# Altium project Low_Level_ECU.PrjPcb (part 4 of 6)

## Sheet 10- RS485.SchDoc: RS485
size 420 x 297 mm; Revision: 1.0; SheetNumber: 10; SheetTotal: 13; Project: LOW LEVEL ECU
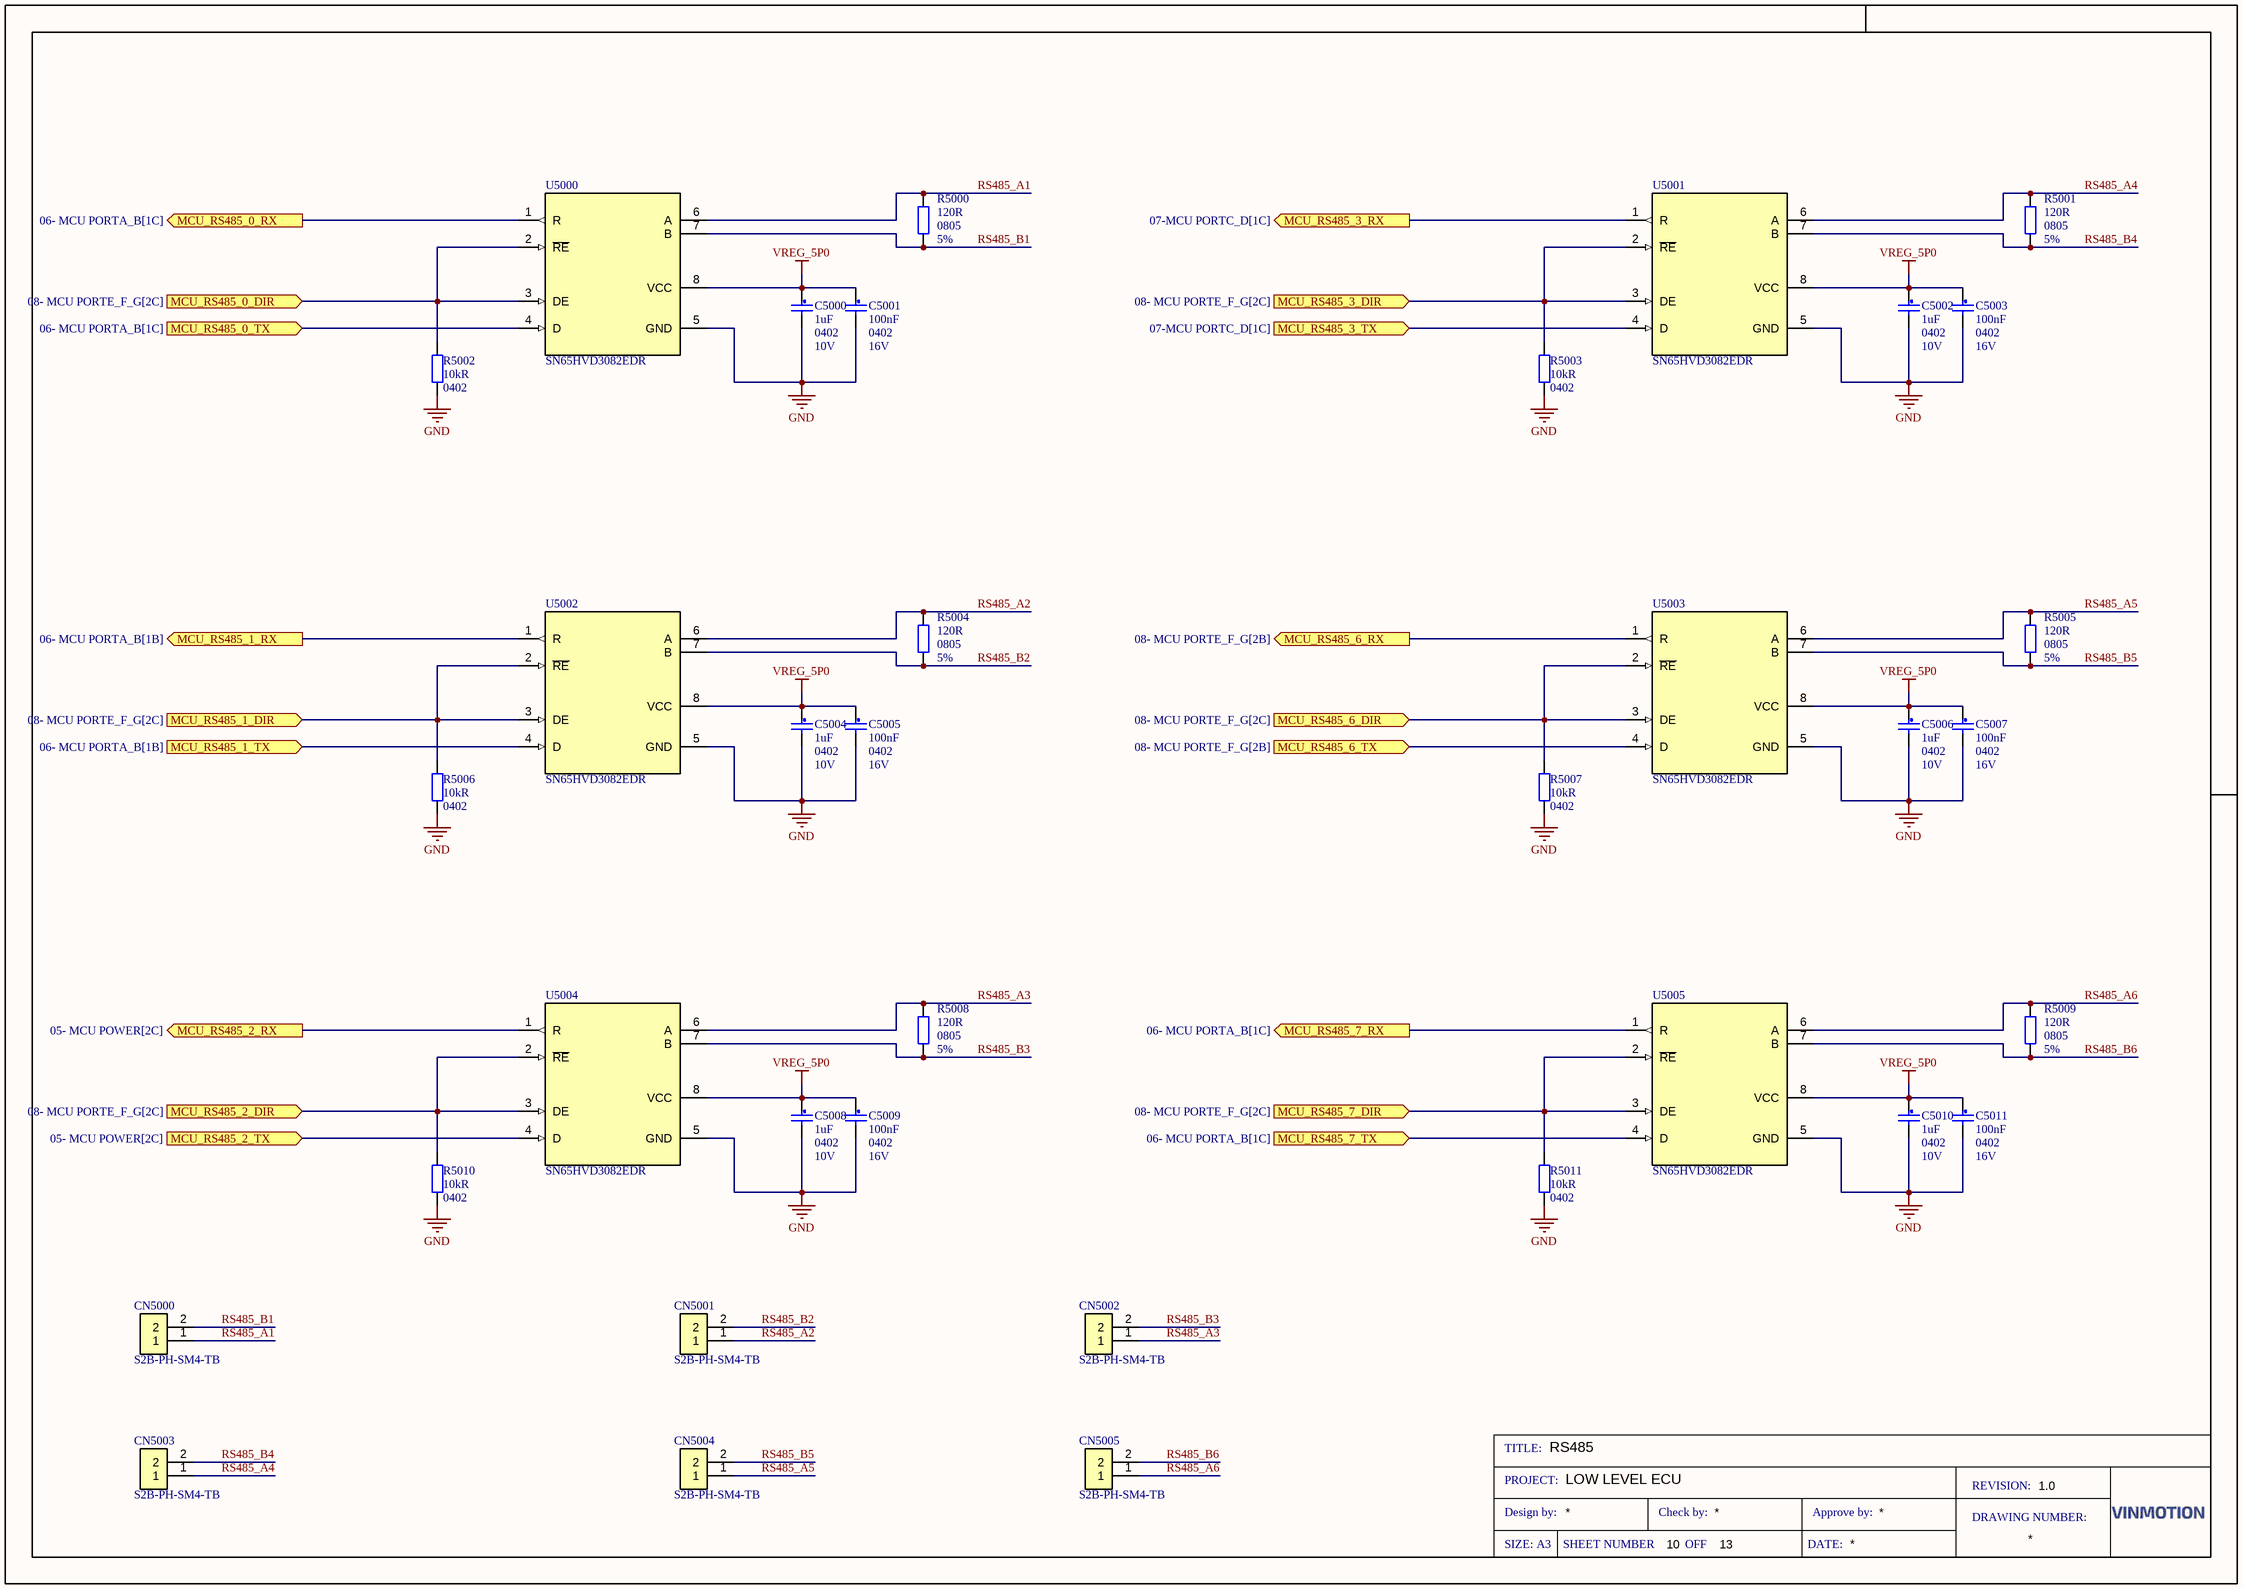
[diagram p8: 10- RS485.SchDoc]

### Parts
C5000  value 1uF  Case/Package: 0402  Rated DC Voltage (URdc): 10V  [CAP0402]  (hidden comment: CL05X105KP5NNNC)
C5001  Capacitance: 100nF  Case/Package: 0402  Voltage Rating (DC): 16V  [CAP0402]  (hidden comment: 0402YC104KAT2A)
C5002  value 1uF  Case/Package: 0402  Rated DC Voltage (URdc): 10V  [CAP0402]  (hidden comment: CL05X105KP5NNNC)
C5003  Capacitance: 100nF  Case/Package: 0402  Voltage Rating (DC): 16V  [CAP0402]  (hidden comment: 0402YC104KAT2A)
C5004  value 1uF  Case/Package: 0402  Rated DC Voltage (URdc): 10V  [CAP0402]  (hidden comment: CL05X105KP5NNNC)
C5005  Capacitance: 100nF  Case/Package: 0402  Voltage Rating (DC): 16V  [CAP0402]  (hidden comment: 0402YC104KAT2A)
C5006  value 1uF  Case/Package: 0402  Rated DC Voltage (URdc): 10V  [CAP0402]  (hidden comment: CL05X105KP5NNNC)
C5007  Capacitance: 100nF  Case/Package: 0402  Voltage Rating (DC): 16V  [CAP0402]  (hidden comment: 0402YC104KAT2A)
C5008  value 1uF  Case/Package: 0402  Rated DC Voltage (URdc): 10V  [CAP0402]  (hidden comment: CL05X105KP5NNNC)
C5009  Capacitance: 100nF  Case/Package: 0402  Voltage Rating (DC): 16V  [CAP0402]  (hidden comment: 0402YC104KAT2A)
C5010  value 1uF  Case/Package: 0402  Rated DC Voltage (URdc): 10V  [CAP0402]  (hidden comment: CL05X105KP5NNNC)
C5011  Capacitance: 100nF  Case/Package: 0402  Voltage Rating (DC): 16V  [CAP0402]  (hidden comment: 0402YC104KAT2A)
CN5000  S2B-PH-SM4-TB  [S2B-PH-SM4-TB]
CN5001  S2B-PH-SM4-TB  [S2B-PH-SM4-TB]
CN5002  S2B-PH-SM4-TB  [S2B-PH-SM4-TB]
CN5003  S2B-PH-SM4-TB  [S2B-PH-SM4-TB]
CN5004  S2B-PH-SM4-TB  [S2B-PH-SM4-TB]
CN5005  S2B-PH-SM4-TB  [S2B-PH-SM4-TB]
R5000  value 120R  Case/Package: 0805  Tolerance: 5%  [RES0805]  (hidden comment: ERJ-P06J121V)
R5001  value 120R  Case/Package: 0805  Tolerance: 5%  [RES0805]  (hidden comment: ERJ-P06J121V)
R5002  Resistance: 10kR  Case/Package: 0402  [RES0402]  (hidden comment: ERJ2GEJ103X)
R5003  Resistance: 10kR  Case/Package: 0402  [RES0402]  (hidden comment: ERJ2GEJ103X)
R5004  value 120R  Case/Package: 0805  Tolerance: 5%  [RES0805]  (hidden comment: ERJ-P06J121V)
R5005  value 120R  Case/Package: 0805  Tolerance: 5%  [RES0805]  (hidden comment: ERJ-P06J121V)
R5006  Resistance: 10kR  Case/Package: 0402  [RES0402]  (hidden comment: ERJ2GEJ103X)
R5007  Resistance: 10kR  Case/Package: 0402  [RES0402]  (hidden comment: ERJ2GEJ103X)
R5008  value 120R  Case/Package: 0805  Tolerance: 5%  [RES0805]  (hidden comment: ERJ-P06J121V)
R5009  value 120R  Case/Package: 0805  Tolerance: 5%  [RES0805]  (hidden comment: ERJ-P06J121V)
R5010  Resistance: 10kR  Case/Package: 0402  [RES0402]  (hidden comment: ERJ2GEJ103X)
R5011  Resistance: 10kR  Case/Package: 0402  [RES0402]  (hidden comment: ERJ2GEJ103X)
U5000  SN65HVD3082EDR  [SOIC127P590X175-8N]
U5001  SN65HVD3082EDR  [SOIC127P590X175-8N]
U5002  SN65HVD3082EDR  [SOIC127P590X175-8N]
U5003  SN65HVD3082EDR  [SOIC127P590X175-8N]
U5004  SN65HVD3082EDR  [SOIC127P590X175-8N]
U5005  SN65HVD3082EDR  [SOIC127P590X175-8N]

### Ports
MCU_RS485_0_DIR (in, see 08- MCU PORTE_F_G[2C]), MCU_RS485_0_RX (out, see 06- MCU PORTA_B[1C]), MCU_RS485_0_TX (in, see 06- MCU PORTA_B[1C]), MCU_RS485_1_DIR (in, see 08- MCU PORTE_F_G[2C]), MCU_RS485_1_RX (out, see 06- MCU PORTA_B[1B]), MCU_RS485_1_TX (in, see 06- MCU PORTA_B[1B]), MCU_RS485_2_DIR (in, see 08- MCU PORTE_F_G[2C]), MCU_RS485_2_RX (out, see 05- MCU POWER[2C]), MCU_RS485_2_TX (in, see 05- MCU POWER[2C]), MCU_RS485_3_DIR (in, see 08- MCU PORTE_F_G[2C]), MCU_RS485_3_RX (out, see 07-MCU PORTC_D[1C]), MCU_RS485_3_TX (in, see 07-MCU PORTC_D[1C]), MCU_RS485_6_DIR (in, see 08- MCU PORTE_F_G[2C]), MCU_RS485_6_RX (out, see 08- MCU PORTE_F_G[2B]), MCU_RS485_6_TX (in, see 08- MCU PORTE_F_G[2B]), MCU_RS485_7_DIR (in, see 08- MCU PORTE_F_G[2C]), MCU_RS485_7_RX (out, see 06- MCU PORTA_B[1C]), MCU_RS485_7_TX (in, see 06- MCU PORTA_B[1C])

### Nets
GND: C5000.2 C5001.2 C5002.2 C5003.2 C5004.2 C5005.2 C5006.2 C5007.2 C5008.2 C5009.2 C5010.2 C5011.2 R5002.1 R5003.1 R5006.1 R5007.1 R5010.1 R5011.1 U5000.5(GND) U5001.5(GND) U5002.5(GND) U5003.5(GND) U5004.5(GND) U5005.5(GND)
VREG_5P0: C5000.1 C5001.1 C5002.1 C5003.1 C5004.1 C5005.1 C5006.1 C5007.1 C5008.1 C5009.1 C5010.1 C5011.1 U5000.8(VCC) U5001.8(VCC) U5002.8(VCC) U5003.8(VCC) U5004.8(VCC) U5005.8(VCC)
RS485_A1: CN5000.1 R5000.1 U5000.6(A)
RS485_A2: CN5001.1 R5004.1 U5002.6(A)
RS485_A3: CN5002.1 R5008.1 U5004.6(A)
RS485_A4: CN5003.1 R5001.1 U5001.6(A)
RS485_A5: CN5004.1 R5005.1 U5003.6(A)
RS485_A6: CN5005.1 R5009.1 U5005.6(A)
RS485_B1: CN5000.2 R5000.2 U5000.7(B)
RS485_B2: CN5001.2 R5004.2 U5002.7(B)
RS485_B3: CN5002.2 R5008.2 U5004.7(B)
RS485_B4: CN5003.2 R5001.2 U5001.7(B)
RS485_B5: CN5004.2 R5005.2 U5003.7(B)
RS485_B6: CN5005.2 R5009.2 U5005.7(B)
NetR5002_2: R5002.2 U5000.2(~{RE}) U5000.3(DE) ; port MCU_RS485_0_DIR
NetR5003_2: R5003.2 U5001.2(~{RE}) U5001.3(DE) ; port MCU_RS485_3_DIR
NetR5006_2: R5006.2 U5002.2(~{RE}) U5002.3(DE) ; port MCU_RS485_1_DIR
NetR5007_2: R5007.2 U5003.2(~{RE}) U5003.3(DE) ; port MCU_RS485_6_DIR
NetR5010_2: R5010.2 U5004.2(~{RE}) U5004.3(DE) ; port MCU_RS485_2_DIR
NetR5011_2: R5011.2 U5005.2(~{RE}) U5005.3(DE) ; port MCU_RS485_7_DIR
NetU3000_B1: U5002.4(D) ; port MCU_RS485_1_TX
NetU3000_C1: U5002.1(R) ; port MCU_RS485_1_RX
NetU3000_C6: U5003.4(D) ; port MCU_RS485_6_TX
NetU3000_D6: U5003.1(R) ; port MCU_RS485_6_RX
NetU3000_F16: U5001.4(D) ; port MCU_RS485_3_TX
NetU3000_F17: U5001.1(R) ; port MCU_RS485_3_RX
NetU3000_J16: U5005.4(D) ; port MCU_RS485_7_TX
NetU3000_J17: U5005.1(R) ; port MCU_RS485_7_RX
NetU3000_K13: U5004.1(R) ; port MCU_RS485_2_RX
NetU3000_L13: U5004.4(D) ; port MCU_RS485_2_TX
NetU3000_P16: U5000.1(R) ; port MCU_RS485_0_RX
NetU3000_R17: U5000.4(D) ; port MCU_RS485_0_TX

### Notes on the sheet
- TITLE:
- PROJECT:
- Design by:
- Check by:
- Approve by:
- DRAWING NUMBER:
- REVISION:
- SIZE: A3
- SHEET NUMBER
- OFF
- DATE:

### Library data of the parts
C5000 C5002 C5004 C5006 C5008 C5010 = CMP-01106-1: CAP CER 1UF 10V X6S 0402; Manufacturer: Samsung; Capacitor Type: Ceramic; Multilayer: Yes; Tolerance  (fill in as +-): 10%; Max Operating Temperature: 105°C; Category: Ceramic Capacitors; Dielectric Material: Ceramic; Height: 0.55mm; JESD-609 Code: e3; Length: 1mm; Manufacturer Part Number: CL05X105KP5NNNC; Min Operating Temperature: -55°C; Mounting Technology: Surface Mount; Pins: 2; Package Shape: Rectangular; Package Style: SMTMeter; Packaging: Tape and Reel; Tolerance (fill in as +-): 10%; Reach SVHC Compliant: Yes; RoHS Compliant: Yes; Temperature Characteristics Code: X6S; Terminal Finish: Nickel; Termination: Wraparound; Width: 0.5mm
C5001 C5003 C5005 C5007 C5009 C5011 = CMP-00988-1: CAP CER 0.1UF 16V X7R 0402; Manufacturer 1: KYOCERA AVX; Crossable(YES/NO): YES; Mount Type(SMD/TH): SMD; Case Code (Imperial): 0402; Case Code (Metric): 1005; Dielectric: X7R; Manufacturer Part Number 1: 0402YC104KAT2A; Max Operating Temperature: 125°C; Min Operating Temperature: -55°C; Mount: Surface Mount; Voltage Rating: 16V
CN5000-CN5005 = CMP-01142-1: CONN HEADER SMD R/A 2POS 2MM; Manufacturer: JST; Manufacturer Part Number: S2BPHSM4TBLFSN; Current Rating: 2A; Insulation Resistance: 1GΩ; Number of Contacts: 2; Voltage Rating: 100V; Housing Color: Natural; Category: Headers and Wire Housings; Color: White; Contact Material: Copper, Tin; Contact Plating: Tin; Height: 5.5mm; Housing Material: Nylon; Lead Free: Lead Free; Lead Pitch: 2mm; Max Operating Temperature: 85°C; Min Operating Temperature: -25°C; Number of Positions: 2; Number of Rows: 1; RoHS: Compliant; Voltage Rating (AC): 100V
R5000 R5001 R5004 R5005 R5008 R5009 = CMP-01121-1: RES SMD 120 OHM 5% 1/2W 0805; Manufacturer: Panasonic; Package Height: 0.6mm; Package Length: 2mm; Package Width: 1.25mm; Power: 500mW; Rated Temperature: 70°C; Reference Standard: AEC-Q200; Temperature Coefficient (ppm/Cel): 200; Working Voltage: 400V; Category: Chip SMD Resistors; Construction: Rectangular; JESD-609 Code: e3; Manufacturer Part Number: ERJ-P06J121V; Max Operating Temperature: 155°C; Min Operating Temperature: -55°C; Mounting Technology: Surface Mount; Pins: 2; Package Shape: Rectangular; Packaging: Tape and Reel; Reach SVHC Compliant: Yes; Resistor Type: FIXED RESISTOR; RoHS Compliant: Yes; Technology: METAL GLAZE/THICK FILM; Terminal Finish: Tin; Termination: Wraparound
R5002 R5003 R5006 R5007 R5010 R5011 = CMP-00039-6: RES SMD 10K OHM 5% 1/10W 0402; Manufacturer 1: Panasonic Electronic Components; Temperature Coefficient: 200ppm/°C; Max Power Dissipation: 100mW; Crossable(YES/NO): YES; Voltage Rating: 50V; Width: 0.02inch; Tolerance: 5%; Number of Terminations: 2; Max Operating Temperature: 155°C; Case Code (Imperial): 0402; Military Standard: Not; Lead Free: Lead Free; Length: 1mm; Manufacturer Part Number 1: ERJ2GEJ103X; Composition: Thick Film; Mount: Surface Mount; REACH SVHC: No SVHC; Mount Type(SMD/TH): SMD; Power Rating: 100mW; Radiation Hardening: No; Package Quantity: 1; Features: Automotive AEC-Q200; Case Code (Metric): 1005; Voltage Rating (DC): 50V; Termination: SMD/SMT; Contact Plating: Tin; Height: 0.35mm; Depth: 0.5mm; Min Operating Temperature: -55°C; Packaging: Cut Tape
U5000-U5005 = CMP-01120-1: IC TRANSCEIVER HALF 1/1 8SOIC; Manufacturer: Texas Instruments; Max Supply Voltage: 5.5V; Differential Output: Yes; Driver Number of Bits: 1; High Level Input Current-Max: 100uA; Input Characteristics: DIFFERENTIAL SCHMITT TRIGGER; Interface IC Type: LINE TRANSCEIVER; Max Supply Current: 900uA; Min Supply Voltage: 4.5V; Out Swing-Min: 1.5V; Output Low Current-Max: 8mA; Package Body Material: Plastic; Package Equivalence Code: SOP8,.25; Power Supplies: 5V; Qualification Status: Not Qualified; Receive Delay-Max: 200ns; Transmit Delay-Max: 1300ns; Category: RS-232 / RS-422 / RS-485 Interface ICs; Height - Seated (Max): 1.75mm; JESD-30 Code: R-PDSO-G8; JESD-609 Code: e4; Length: 4.9mm; Manufacturer Part Number: SN65HVD3082EDR; Max Operating Temperature: 85°C; Min Operating Temperature: -40°C; Moisture Sensitivity Level: 1; Channels: 1; Pins: 8; Case/Package: SOP; Package Shape: Rectangular; Package Style: SMALL OUTLINEMeter; Peak Reflow Temperature (Cel): 260°C; Reach SVHC Compliant: Yes; Receiver Number of Bits: 1; RoHS Compliant: Yes; Nominal Supply Voltage: 5V; Surface Mount: Yes; Technology: CMOS; Temperature Grade: INDUSTRIAL; Terminal Finish: Nickel; Terminal Form: Gull Wing; Terminal Pitch: 1.27mm; Terminal Position: DUAL; Width: 3.9mm

## Sheet 11- Ethernet MAC.SchDoc: ETHERNET
size 420 x 297 mm; Revision: 1.0; SheetNumber: 11; SheetTotal: 13; Project: LOW LEVEL ECU
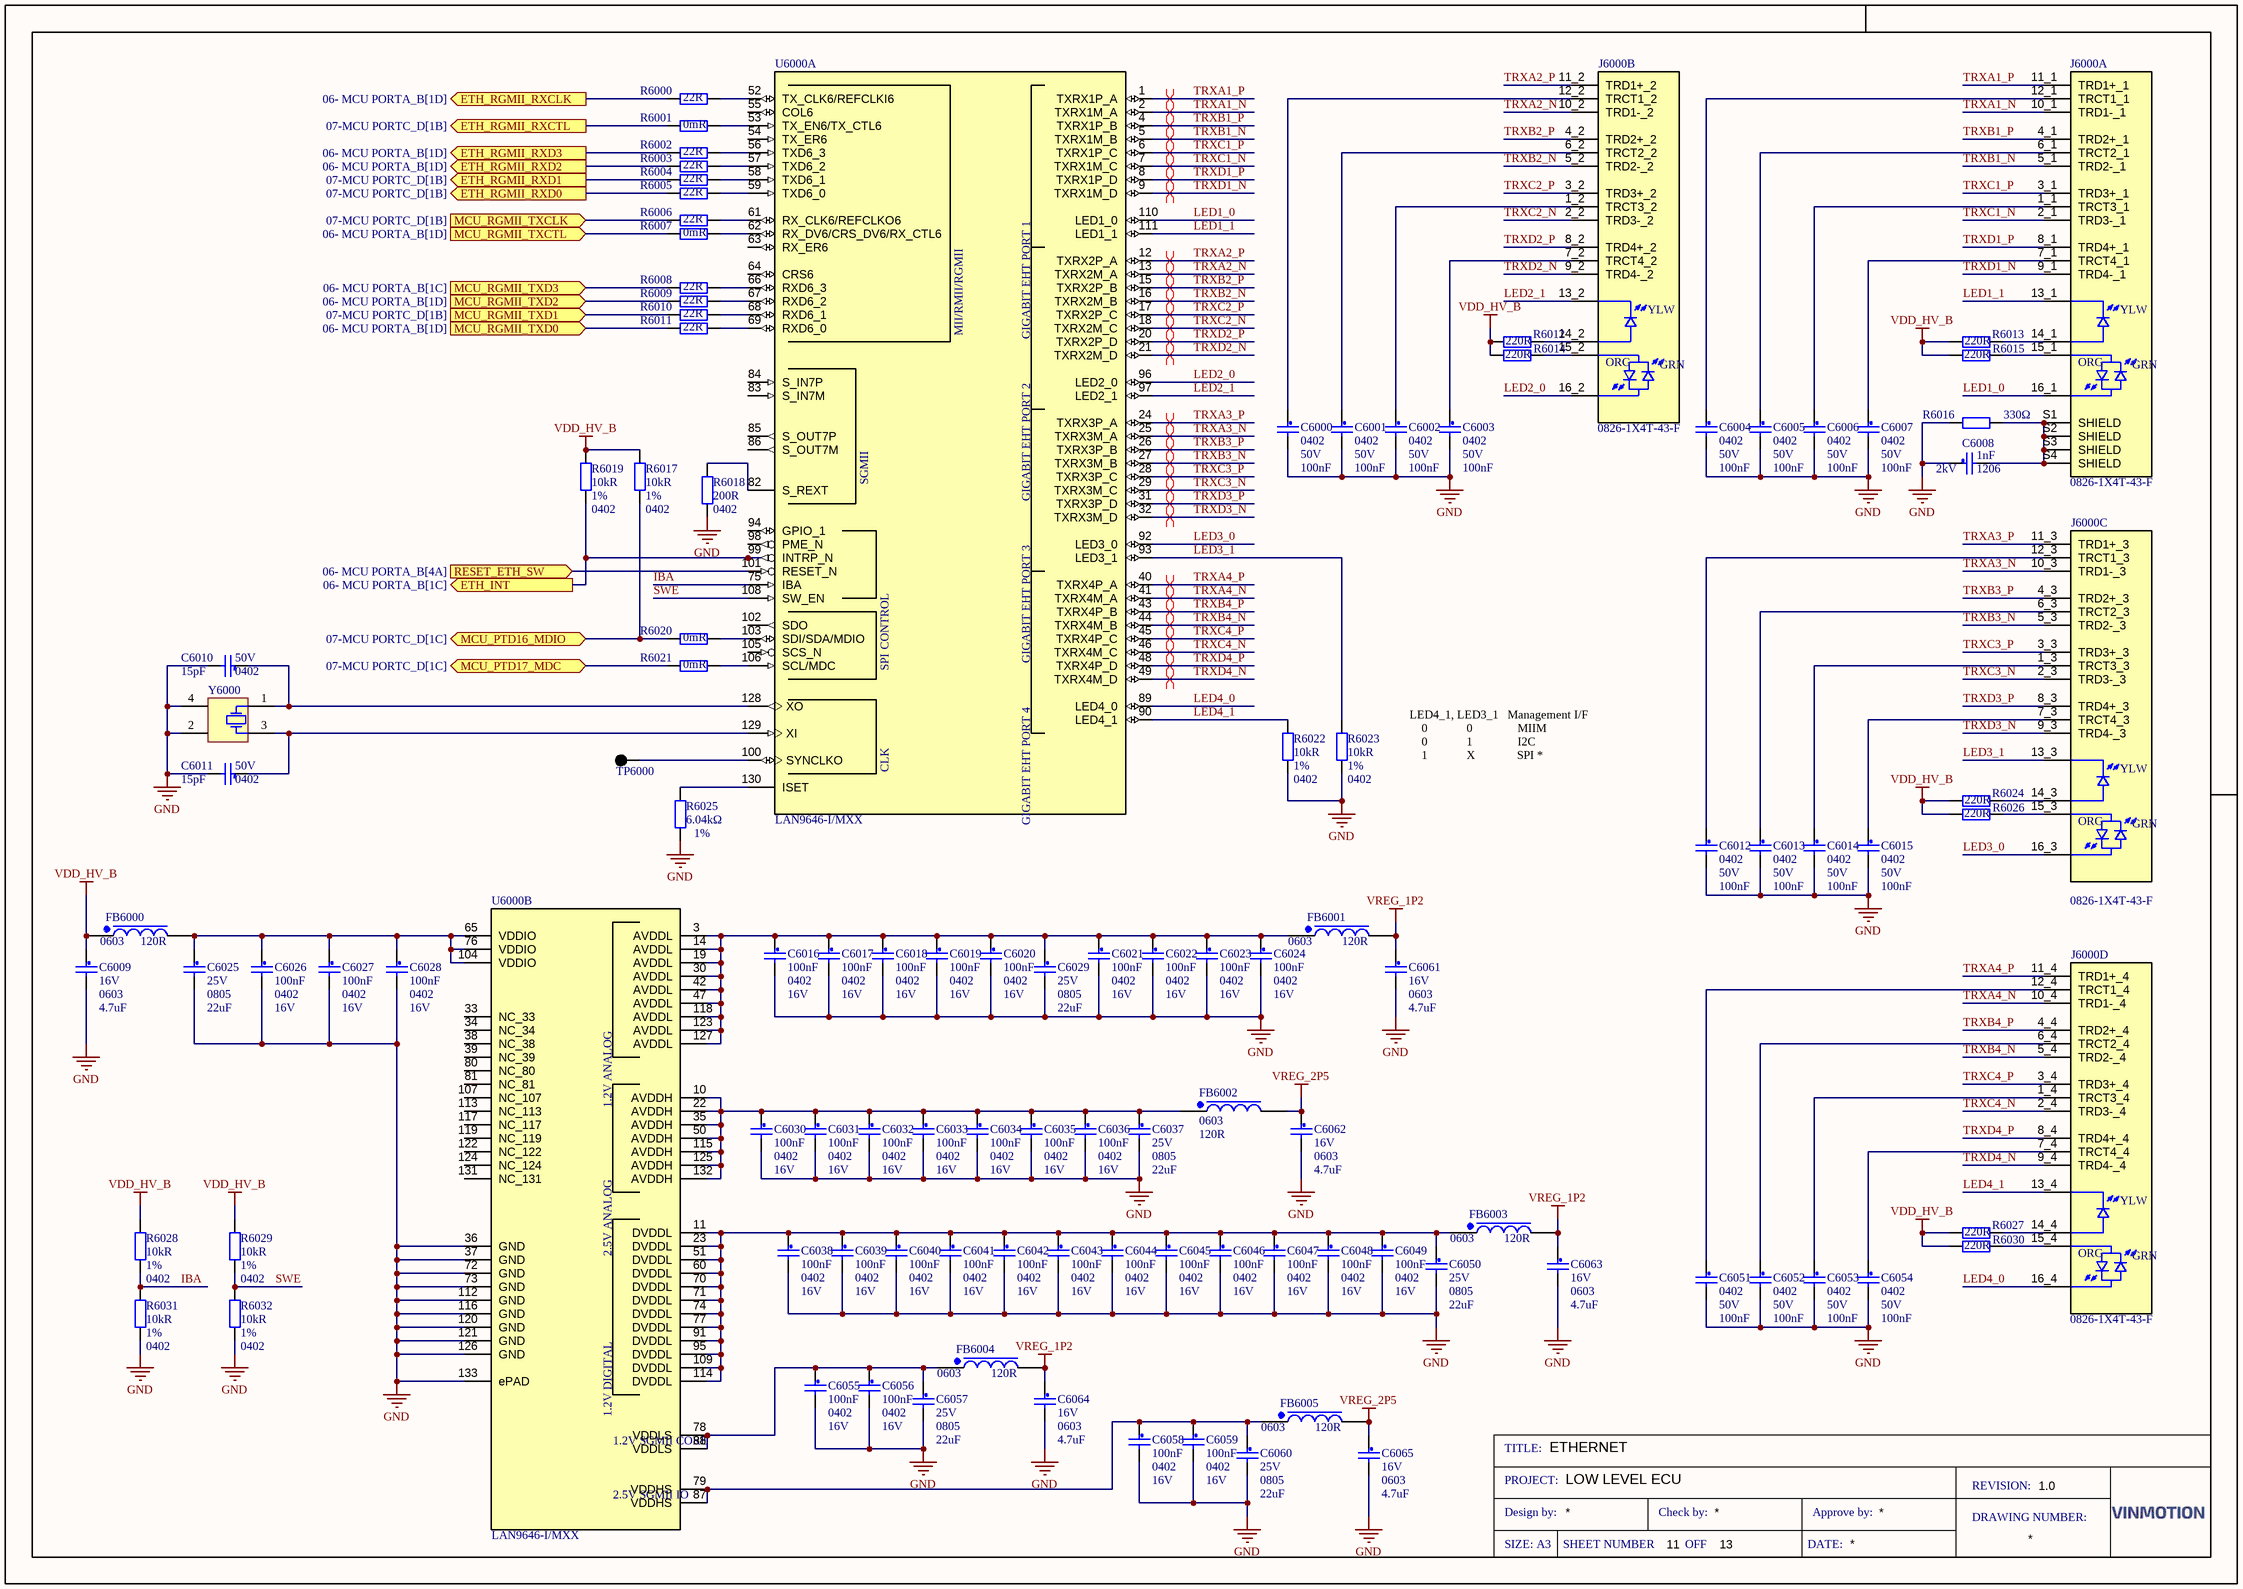
[diagram p9: 11- Ethernet MAC.SchDoc]

### Parts
C6000  Case/Package: 0402  Voltage Rating: 50V  Capacitance: 100nF  [CAP0402]  (hidden comment: CL05B104KB54PNC)
C6001  Case/Package: 0402  Voltage Rating: 50V  Capacitance: 100nF  [CAP0402]  (hidden comment: CL05B104KB54PNC)
C6002  Case/Package: 0402  Voltage Rating: 50V  Capacitance: 100nF  [CAP0402]  (hidden comment: CL05B104KB54PNC)
C6003  Case/Package: 0402  Voltage Rating: 50V  Capacitance: 100nF  [CAP0402]  (hidden comment: CL05B104KB54PNC)
C6004  Case/Package: 0402  Voltage Rating: 50V  Capacitance: 100nF  [CAP0402]  (hidden comment: CL05B104KB54PNC)
C6005  Case/Package: 0402  Voltage Rating: 50V  Capacitance: 100nF  [CAP0402]  (hidden comment: CL05B104KB54PNC)
C6006  Case/Package: 0402  Voltage Rating: 50V  Capacitance: 100nF  [CAP0402]  (hidden comment: CL05B104KB54PNC)
C6007  Case/Package: 0402  Voltage Rating: 50V  Capacitance: 100nF  [CAP0402]  (hidden comment: CL05B104KB54PNC)
C6008  Voltage Rating: 2kV  Case/Package: 1206  Capacitance: 1nF  [CAP1206]  (hidden comment: C1206C102KGRACAUTO)
C6009  Voltage Rating: 16V  Case/Package: 0603  Capacitance: 4.7uF  [CAP0603]  (hidden comment: GRT188C81C475KE13D)
C6010  Voltage Rating: 50V  Case/Package: 0402  Capacitance: 15pF  [CAP0402]  (hidden comment: GCM1555C1H150JA16D)
C6011  Voltage Rating: 50V  Case/Package: 0402  Capacitance: 15pF  [CAP0402]  (hidden comment: GCM1555C1H150JA16D)
C6012  Case/Package: 0402  Voltage Rating: 50V  Capacitance: 100nF  [CAP0402]  (hidden comment: CL05B104KB54PNC)
C6013  Case/Package: 0402  Voltage Rating: 50V  Capacitance: 100nF  [CAP0402]  (hidden comment: CL05B104KB54PNC)
C6014  Case/Package: 0402  Voltage Rating: 50V  Capacitance: 100nF  [CAP0402]  (hidden comment: CL05B104KB54PNC)
C6015  Case/Package: 0402  Voltage Rating: 50V  Capacitance: 100nF  [CAP0402]  (hidden comment: CL05B104KB54PNC)
C6016  Capacitance: 100nF  Case/Package: 0402  Voltage Rating (DC): 16V  [CAP0402]  (hidden comment: 0402YC104KAT2A)
C6017  Capacitance: 100nF  Case/Package: 0402  Voltage Rating (DC): 16V  [CAP0402]  (hidden comment: 0402YC104KAT2A)
C6018  Capacitance: 100nF  Case/Package: 0402  Voltage Rating (DC): 16V  [CAP0402]  (hidden comment: 0402YC104KAT2A)
C6019  Capacitance: 100nF  Case/Package: 0402  Voltage Rating (DC): 16V  [CAP0402]  (hidden comment: 0402YC104KAT2A)
C6020  Capacitance: 100nF  Case/Package: 0402  Voltage Rating (DC): 16V  [CAP0402]  (hidden comment: 0402YC104KAT2A)
C6021  Capacitance: 100nF  Case/Package: 0402  Voltage Rating (DC): 16V  [CAP0402]  (hidden comment: 0402YC104KAT2A)
C6022  Capacitance: 100nF  Case/Package: 0402  Voltage Rating (DC): 16V  [CAP0402]  (hidden comment: 0402YC104KAT2A)
C6023  Capacitance: 100nF  Case/Package: 0402  Voltage Rating (DC): 16V  [CAP0402]  (hidden comment: 0402YC104KAT2A)
C6024  Capacitance: 100nF  Case/Package: 0402  Voltage Rating (DC): 16V  [CAP0402]  (hidden comment: 0402YC104KAT2A)
C6025  Voltage Rating: 25V  Case/Package: 0805  Capacitance: 22uF  [CAP0805]  (hidden comment: GRM21BR61E226ME44K)
C6026  Capacitance: 100nF  Case/Package: 0402  Voltage Rating (DC): 16V  [CAP0402]  (hidden comment: 0402YC104KAT2A)
C6027  Capacitance: 100nF  Case/Package: 0402  Voltage Rating (DC): 16V  [CAP0402]  (hidden comment: 0402YC104KAT2A)
C6028  Capacitance: 100nF  Case/Package: 0402  Voltage Rating (DC): 16V  [CAP0402]  (hidden comment: 0402YC104KAT2A)
C6029  Voltage Rating: 25V  Case/Package: 0805  Capacitance: 22uF  [CAP0805]  (hidden comment: GRM21BR61E226ME44K)
C6030  Capacitance: 100nF  Case/Package: 0402  Voltage Rating (DC): 16V  [CAP0402]  (hidden comment: 0402YC104KAT2A)
C6031  Capacitance: 100nF  Case/Package: 0402  Voltage Rating (DC): 16V  [CAP0402]  (hidden comment: 0402YC104KAT2A)
C6032  Capacitance: 100nF  Case/Package: 0402  Voltage Rating (DC): 16V  [CAP0402]  (hidden comment: 0402YC104KAT2A)
C6033  Capacitance: 100nF  Case/Package: 0402  Voltage Rating (DC): 16V  [CAP0402]  (hidden comment: 0402YC104KAT2A)
C6034  Capacitance: 100nF  Case/Package: 0402  Voltage Rating (DC): 16V  [CAP0402]  (hidden comment: 0402YC104KAT2A)
C6035  Capacitance: 100nF  Case/Package: 0402  Voltage Rating (DC): 16V  [CAP0402]  (hidden comment: 0402YC104KAT2A)
C6036  Capacitance: 100nF  Case/Package: 0402  Voltage Rating (DC): 16V  [CAP0402]  (hidden comment: 0402YC104KAT2A)
C6037  Voltage Rating: 25V  Case/Package: 0805  Capacitance: 22uF  [CAP0805]  (hidden comment: GRM21BR61E226ME44K)
C6038  Capacitance: 100nF  Case/Package: 0402  Voltage Rating (DC): 16V  [CAP0402]  (hidden comment: 0402YC104KAT2A)
C6039  Capacitance: 100nF  Case/Package: 0402  Voltage Rating (DC): 16V  [CAP0402]  (hidden comment: 0402YC104KAT2A)
C6040  Capacitance: 100nF  Case/Package: 0402  Voltage Rating (DC): 16V  [CAP0402]  (hidden comment: 0402YC104KAT2A)
C6041  Capacitance: 100nF  Case/Package: 0402  Voltage Rating (DC): 16V  [CAP0402]  (hidden comment: 0402YC104KAT2A)
C6042  Capacitance: 100nF  Case/Package: 0402  Voltage Rating (DC): 16V  [CAP0402]  (hidden comment: 0402YC104KAT2A)
C6043  Capacitance: 100nF  Case/Package: 0402  Voltage Rating (DC): 16V  [CAP0402]  (hidden comment: 0402YC104KAT2A)
C6044  Capacitance: 100nF  Case/Package: 0402  Voltage Rating (DC): 16V  [CAP0402]  (hidden comment: 0402YC104KAT2A)
C6045  Capacitance: 100nF  Case/Package: 0402  Voltage Rating (DC): 16V  [CAP0402]  (hidden comment: 0402YC104KAT2A)
C6046  Capacitance: 100nF  Case/Package: 0402  Voltage Rating (DC): 16V  [CAP0402]  (hidden comment: 0402YC104KAT2A)
C6047  Capacitance: 100nF  Case/Package: 0402  Voltage Rating (DC): 16V  [CAP0402]  (hidden comment: 0402YC104KAT2A)
C6048  Capacitance: 100nF  Case/Package: 0402  Voltage Rating (DC): 16V  [CAP0402]  (hidden comment: 0402YC104KAT2A)
C6049  Capacitance: 100nF  Case/Package: 0402  Voltage Rating (DC): 16V  [CAP0402]  (hidden comment: 0402YC104KAT2A)
C6050  Voltage Rating: 25V  Case/Package: 0805  Capacitance: 22uF  [CAP0805]  (hidden comment: GRM21BR61E226ME44K)
C6051  Case/Package: 0402  Voltage Rating: 50V  Capacitance: 100nF  [CAP0402]  (hidden comment: CL05B104KB54PNC)
C6052  Case/Package: 0402  Voltage Rating: 50V  Capacitance: 100nF  [CAP0402]  (hidden comment: CL05B104KB54PNC)
C6053  Case/Package: 0402  Voltage Rating: 50V  Capacitance: 100nF  [CAP0402]  (hidden comment: CL05B104KB54PNC)
C6054  Case/Package: 0402  Voltage Rating: 50V  Capacitance: 100nF  [CAP0402]  (hidden comment: CL05B104KB54PNC)
C6055  Capacitance: 100nF  Case/Package: 0402  Voltage Rating (DC): 16V  [CAP0402]  (hidden comment: 0402YC104KAT2A)
C6056  Capacitance: 100nF  Case/Package: 0402  Voltage Rating (DC): 16V  [CAP0402]  (hidden comment: 0402YC104KAT2A)
C6057  Voltage Rating: 25V  Case/Package: 0805  Capacitance: 22uF  [CAP0805]  (hidden comment: GRM21BR61E226ME44K)
C6058  Capacitance: 100nF  Case/Package: 0402  Voltage Rating (DC): 16V  [CAP0402]  (hidden comment: 0402YC104KAT2A)
C6059  Capacitance: 100nF  Case/Package: 0402  Voltage Rating (DC): 16V  [CAP0402]  (hidden comment: 0402YC104KAT2A)
C6060  Voltage Rating: 25V  Case/Package: 0805  Capacitance: 22uF  [CAP0805]  (hidden comment: GRM21BR61E226ME44K)
C6061  Voltage Rating: 16V  Case/Package: 0603  Capacitance: 4.7uF  [CAP0603]  (hidden comment: GRT188C81C475KE13D)
C6062  Voltage Rating: 16V  Case/Package: 0603  Capacitance: 4.7uF  [CAP0603]  (hidden comment: GRT188C81C475KE13D)
C6063  Voltage Rating: 16V  Case/Package: 0603  Capacitance: 4.7uF  [CAP0603]  (hidden comment: GRT188C81C475KE13D)
C6064  Voltage Rating: 16V  Case/Package: 0603  Capacitance: 4.7uF  [CAP0603]  (hidden comment: GRT188C81C475KE13D)
C6065  Voltage Rating: 16V  Case/Package: 0603  Capacitance: 4.7uF  [CAP0603]  (hidden comment: GRT188C81C475KE13D)
FB6000  Case/Package: 0603  Impedance: 120R  [FB0603]  (hidden comment: BLM18KG121TH1D)
FB6001  Case/Package: 0603  Impedance: 120R  [FB0603]  (hidden comment: BLM18KG121TH1D)
FB6002  Case/Package: 0603  Impedance: 120R  [FB0603]  (hidden comment: BLM18KG121TH1D)
FB6003  Case/Package: 0603  Impedance: 120R  [FB0603]  (hidden comment: BLM18KG121TH1D)
FB6004  Case/Package: 0603  Impedance: 120R  [FB0603]  (hidden comment: BLM18KG121TH1D)
FB6005  Case/Package: 0603  Impedance: 120R  [FB0603]  (hidden comment: BLM18KG121TH1D)
J6000  0826-1X4T-43-F  [CONN JACK 4PORT PCB]  (parts A,B,C,D of 4)
R6000  Resistance: 22R  [RES0402]  (hidden comment: CRCW040222R0JNED)
R6001  Resistance: 0mR  [RES0402]  (hidden comment: RMCF0402ZT0R00)
R6002  Resistance: 22R  [RES0402]  (hidden comment: CRCW040222R0JNED)
R6003  Resistance: 22R  [RES0402]  (hidden comment: CRCW040222R0JNED)
R6004  Resistance: 22R  [RES0402]  (hidden comment: CRCW040222R0JNED)
R6005  Resistance: 22R  [RES0402]  (hidden comment: CRCW040222R0JNED)
R6006  Resistance: 22R  [RES0402]  (hidden comment: CRCW040222R0JNED)
R6007  Resistance: 0mR  [RES0402]  (hidden comment: RMCF0402ZT0R00)
R6008  Resistance: 22R  [RES0402]  (hidden comment: CRCW040222R0JNED)
R6009  Resistance: 22R  [RES0402]  (hidden comment: CRCW040222R0JNED)
R6010  Resistance: 22R  [RES0402]  (hidden comment: CRCW040222R0JNED)
R6011  Resistance: 22R  [RES0402]  (hidden comment: CRCW040222R0JNED)
R6012  value 220R  [RES0402]  (hidden comment: CRCW0402220RFKED)
R6013  value 220R  [RES0402]  (hidden comment: CRCW0402220RFKED)
R6014  value 220R  [RES0402]  (hidden comment: CRCW0402220RFKED)
R6015  value 220R  [RES0402]  (hidden comment: CRCW0402220RFKED)
R6016  value 330Ω  [RES0603]  (hidden comment: RC0603JR-07330RL)
R6017  value 10kR  Tolerance: 1%  Case/Package: 0402  [RES0402]  (hidden comment: RMCF0402FT10K0)
R6018  Resistance: 200R  Case/Package: 0402  [RES0402]  (hidden comment: AC0402FR-07200RL)
R6019  value 10kR  Tolerance: 1%  Case/Package: 0402  [RES0402]  (hidden comment: RMCF0402FT10K0)
R6020  Resistance: 0mR  [RES0402]  (hidden comment: RMCF0402ZT0R00)
R6021  Resistance: 0mR  [RES0402]  (hidden comment: RMCF0402ZT0R00)
R6022  value 10kR  Tolerance: 1%  Case/Package: 0402  [RES0402]  (hidden comment: RMCF0402FT10K0)
R6023  value 10kR  Tolerance: 1%  Case/Package: 0402  [RES0402]  (hidden comment: RMCF0402FT10K0)
R6024  value 220R  [RES0402]  (hidden comment: CRCW0402220RFKED)
R6025  value 6.04kΩ  Tolerance: 1%  [RES0402]  (hidden comment: CRCW04026K04FKEDC)
R6026  value 220R  [RES0402]  (hidden comment: CRCW0402220RFKED)
R6027  value 220R  [RES0402]  (hidden comment: CRCW0402220RFKED)
R6028  value 10kR  Tolerance: 1%  Case/Package: 0402  [RES0402]  (hidden comment: RMCF0402FT10K0)
R6029  value 10kR  Tolerance: 1%  Case/Package: 0402  [RES0402]  (hidden comment: RMCF0402FT10K0)
R6030  value 220R  [RES0402]  (hidden comment: CRCW0402220RFKED)
R6031  value 10kR  Tolerance: 1%  Case/Package: 0402  [RES0402]  (hidden comment: RMCF0402FT10K0)
R6032  value 10kR  Tolerance: 1%  Case/Package: 0402  [RES0402]  (hidden comment: RMCF0402FT10K0)
TP6000  TP  [TP-SMD-R1]  (value not drawn)  (no BOM)
U6000  LAN9646-I/MXX  [132-VFQFN Dual Rows, Exposed Pad]  (parts A,B of 2)
Y6000  NX3225SA-25.000M-STD-CRS-2  [NDK_NX3225SA-25.000M-STD-CRS-2_R]  (value not drawn)

### Ports
ETH_INT (out, see 06- MCU PORTA_B[1C]), ETH_RGMII_RXCLK (out, see 06- MCU PORTA_B[1D]), ETH_RGMII_RXCTL (out, see 07-MCU PORTC_D[1B]), ETH_RGMII_RXD0 (out, see 07-MCU PORTC_D[1B]), ETH_RGMII_RXD1 (out, see 07-MCU PORTC_D[1B]), ETH_RGMII_RXD2 (out, see 06- MCU PORTA_B[1D]), ETH_RGMII_RXD3 (out, see 06- MCU PORTA_B[1D]), MCU_PTD16_MDIO (bidir, see 07-MCU PORTC_D[1C]), MCU_PTD17_MDC (bidir, see 07-MCU PORTC_D[1C]), MCU_RGMII_TXCLK (in, see 07-MCU PORTC_D[1B]), MCU_RGMII_TXCTL (in, see 06- MCU PORTA_B[1D]), MCU_RGMII_TXD0 (in, see 06- MCU PORTA_B[1D]), MCU_RGMII_TXD1 (in, see 07-MCU PORTC_D[1B]), MCU_RGMII_TXD2 (in, see 06- MCU PORTA_B[1D]), MCU_RGMII_TXD3 (in, see 06- MCU PORTA_B[1C]), RESET_ETH_SW (in, see 06- MCU PORTA_B[4A])

### Nets
GND: C6000.2 C6001.2 C6002.2 C6003.2 C6004.2 C6005.2 C6006.2 C6007.2 C6008.1 C6009.2 C6010.2 C6011.2 C6012.2 C6013.2 C6014.2 C6015.2 C6016.2 C6017.2 C6018.2 C6019.2 C6020.2 C6021.2 C6022.2 C6023.2 C6024.2 C6025.2 C6026.2 C6027.2 C6028.2 C6029.2 C6030.2 C6031.2 C6032.2 C6033.2 C6034.2 C6035.2 C6036.2 C6037.2 C6038.2 C6039.2 C6040.2 C6041.2 C6042.2 C6043.2 C6044.2 C6045.2 C6046.2 C6047.2 C6048.2 C6049.2 C6050.2 C6051.2 C6052.2 C6053.2 C6054.2 C6055.2 C6056.2 C6057.2 C6058.2 C6059.2 C6060.2 C6061.2 C6062.2 C6063.2 C6064.2 C6065.2 R6016.2 R6018.1 R6022.1 R6023.1 R6025.2 R6031.1 R6032.1 U6000.36(GND) U6000.37(GND) U6000.72(GND) U6000.73(GND) U6000.112(GND) U6000.116(GND) U6000.120(GND) U6000.121(GND) U6000.126(GND) U6000.133(ePAD) Y6000.2(GND) Y6000.4(GND)
VDD_HV_B: C6009.1 FB6000.1 R6012.2 R6013.2 R6014.2 R6015.2 R6017.2 R6019.2 R6024.2 R6026.2 R6027.2 R6028.2 R6029.2 R6030.2
VREG_1P2: C6061.1 C6063.1 C6064.1 FB6001.2 FB6003.2 FB6004.2
VREG_2P5: C6062.1 C6065.1 FB6002.2 FB6005.2
IBA: R6028.1 R6031.2 U6000.75(IBA)
LED1_0: J6000.16_1 U6000.110(LED1_0)
LED1_1: J6000.13_1 U6000.111(LED1_1)
LED2_0: J6000.16_2 U6000.96(LED2_0)
LED2_1: J6000.13_2 U6000.97(LED2_1)
LED3_0: J6000.16_3 U6000.92(LED3_0)
LED3_1: J6000.13_3 R6023.2 U6000.93(LED3_1)
LED4_0: J6000.16_4 U6000.89(LED4_0)
LED4_1: J6000.13_4 R6022.2 U6000.90(LED4_1)
SWE: R6029.1 R6032.2 U6000.108(SW_EN)
TRXA1_N: J6000.10_1(TRD1-_1) U6000.2(TXRX1M_A)
TRXA1_P: J6000.11_1(TRD1+_1) U6000.1(TXRX1P_A)
TRXA2_N: J6000.10_2(TRD1-_2) U6000.13(TXRX2M_A)
TRXA2_P: J6000.11_2(TRD1+_2) U6000.12(TXRX2P_A)
TRXA3_N: J6000.10_3(TRD1-_3) U6000.25(TXRX3M_A)
TRXA3_P: J6000.11_3(TRD1+_3) U6000.24(TXRX3P_A)
TRXA4_N: J6000.10_4(TRD1-_4) U6000.41(TXRX4M_A)
TRXA4_P: J6000.11_4(TRD1+_4) U6000.40(TXRX4P_A)
TRXB1_N: J6000.5_1(TRD2-_1) U6000.5(TXRX1M_B)
TRXB1_P: J6000.4_1(TRD2+_1) U6000.4(TXRX1P_B)
TRXB2_N: J6000.5_2(TRD2-_2) U6000.16(TXRX2M_B)
TRXB2_P: J6000.4_2(TRD2+_2) U6000.15(TXRX2P_B)
TRXB3_N: J6000.5_3(TRD2-_3) U6000.27(TXRX3M_B)
TRXB3_P: J6000.4_3(TRD2+_3) U6000.26(TXRX3P_B)
TRXB4_N: J6000.5_4(TRD2-_4) U6000.44(TXRX4M_B)
TRXB4_P: J6000.4_4(TRD2+_4) U6000.43(TXRX4P_B)
TRXC1_N: J6000.2_1(TRD3-_1) U6000.7(TXRX1M_C)
TRXC1_P: J6000.3_1(TRD3+_1) U6000.6(TXRX1P_C)
TRXC2_N: J6000.2_2(TRD3-_2) U6000.18(TXRX2M_C)
TRXC2_P: J6000.3_2(TRD3+_2) U6000.17(TXRX2P_C)
TRXC3_N: J6000.2_3(TRD3-_3) U6000.29(TXRX3M_C)
TRXC3_P: J6000.3_3(TRD3+_3) U6000.28(TXRX3P_C)
TRXC4_N: J6000.2_4(TRD3-_4) U6000.46(TXRX4M_C)
TRXC4_P: J6000.3_4(TRD3+_4) U6000.45(TXRX4P_C)
TRXD1_N: J6000.9_1(TRD4-_1) U6000.9(TXRX1M_D)
TRXD1_P: J6000.8_1(TRD4+_1) U6000.8(TXRX1P_D)
TRXD2_N: J6000.9_2(TRD4-_2) U6000.21(TXRX2M_D)
TRXD2_P: J6000.8_2(TRD4+_2) U6000.20(TXRX2P_D)
TRXD3_N: J6000.9_3(TRD4-_3) U6000.32(TXRX3M_D)
TRXD3_P: J6000.8_3(TRD4+_3) U6000.31(TXRX3P_D)
TRXD4_N: J6000.9_4(TRD4-_4) U6000.49(TXRX4M_D)
TRXD4_P: J6000.8_4(TRD4+_4) U6000.48(TXRX4P_D)
NetC6000_1: C6000.1 J6000.12_2(TRCT1_2)
NetC6001_1: C6001.1 J6000.6_2(TRCT2_2)
NetC6002_1: C6002.1 J6000.1_2(TRCT3_2)
NetC6003_1: C6003.1 J6000.7_2(TRCT4_2)
NetC6004_1: C6004.1 J6000.12_1(TRCT1_1)
NetC6005_1: C6005.1 J6000.6_1(TRCT2_1)
NetC6006_1: C6006.1 J6000.1_1(TRCT3_1)
NetC6007_1: C6007.1 J6000.7_1(TRCT4_1)
NetC6008_2: C6008.2 J6000.S1(SHIELD) J6000.S2(SHIELD) J6000.S3(SHIELD) J6000.S4(SHIELD) R6016.1
NetC6010_1: C6010.1 U6000.128(XO) Y6000.1(OSC1)
NetC6011_1: C6011.1 U6000.129(XI) Y6000.3(OSC2)
NetC6012_1: C6012.1 J6000.12_3(TRCT1_3)
NetC6013_1: C6013.1 J6000.6_3(TRCT2_3)
NetC6014_1: C6014.1 J6000.1_3(TRCT3_3)
NetC6015_1: C6015.1 J6000.7_3(TRCT4_3)
NetC6016_1: C6016.1 C6017.1 C6018.1 C6019.1 C6020.1 C6021.1 C6022.1 C6023.1 C6024.1 C6029.1 FB6001.1 U6000.3(AVDDL) U6000.14(AVDDL) U6000.19(AVDDL) U6000.30(AVDDL) U6000.42(AVDDL) U6000.47(AVDDL) U6000.118(AVDDL) U6000.123(AVDDL) U6000.127(AVDDL)
NetC6025_1: C6025.1 C6026.1 C6027.1 C6028.1 FB6000.2 U6000.65(VDDIO) U6000.76(VDDIO) U6000.104(VDDIO)
NetC6030_1: C6030.1 C6031.1 C6032.1 C6033.1 C6034.1 C6035.1 C6036.1 C6037.1 FB6002.1 U6000.10(AVDDH) U6000.22(AVDDH) U6000.35(AVDDH) U6000.50(AVDDH) U6000.115(AVDDH) U6000.125(AVDDH) U6000.132(AVDDH)
NetC6038_1: C6038.1 C6039.1 C6040.1 C6041.1 C6042.1 C6043.1 C6044.1 C6045.1 C6046.1 C6047.1 C6048.1 C6049.1 C6050.1 FB6003.1 U6000.11(DVDDL) U6000.23(DVDDL) U6000.51(DVDDL) U6000.60(DVDDL) U6000.70(DVDDL) U6000.71(DVDDL) U6000.74(DVDDL) U6000.77(DVDDL) U6000.91(DVDDL) U6000.95(DVDDL) U6000.109(DVDDL) U6000.114(DVDDL)
NetC6051_1: C6051.1 J6000.12_4(TRCT1_4)
NetC6052_1: C6052.1 J6000.6_4(TRCT2_4)
NetC6053_1: C6053.1 J6000.1_4(TRCT3_4)
NetC6054_1: C6054.1 J6000.7_4(TRCT4_4)
NetC6055_1: C6055.1 C6056.1 C6057.1 FB6004.1 U6000.78(VDDLS) U6000.88(VDDLS)
NetC6058_1: C6058.1 C6059.1 C6060.1 FB6005.1 U6000.79(VDDHS) U6000.87(VDDHS)
NetJ6000_14_1: J6000.14_1 R6013.1
NetJ6000_14_2: J6000.14_2 R6012.1
NetJ6000_14_3: J6000.14_3 R6024.1
NetJ6000_14_4: J6000.14_4 R6027.1
NetJ6000_15_1: J6000.15_1 R6015.1
NetJ6000_15_2: J6000.15_2 R6014.1
NetJ6000_15_3: J6000.15_3 R6026.1
NetJ6000_15_4: J6000.15_4 R6030.1
NetR3005_1: U6000.101(RESET_N) ; port RESET_ETH_SW
NetR6000_1: R6000.1 ; port ETH_RGMII_RXCLK
NetR6000_2: R6000.2 U6000.52(TX_CLK6/REFCLKI6)
NetR6001_1: R6001.1 ; port ETH_RGMII_RXCTL
NetR6001_2: R6001.2 U6000.53(TX_EN6/TX_CTL6)
NetR6002_1: R6002.1 ; port ETH_RGMII_RXD3
NetR6002_2: R6002.2 U6000.56(TXD6_3)
NetR6003_1: R6003.1 ; port ETH_RGMII_RXD2
NetR6003_2: R6003.2 U6000.57(TXD6_2)
NetR6004_1: R6004.1 ; port ETH_RGMII_RXD1
NetR6004_2: R6004.2 U6000.58(TXD6_1)
NetR6005_1: R6005.1 ; port ETH_RGMII_RXD0
NetR6005_2: R6005.2 U6000.59(TXD6_0)
NetR6006_1: R6006.1 ; port MCU_RGMII_TXCLK
NetR6006_2: R6006.2 U6000.61(RX_CLK6/REFCLKO6)
NetR6007_1: R6007.1 ; port MCU_RGMII_TXCTL
NetR6007_2: R6007.2 U6000.62(RX_DV6/CRS_DV6/RX_CTL6)
NetR6008_1: R6008.1 ; port MCU_RGMII_TXD3
NetR6008_2: R6008.2 U6000.66(RXD6_3)
NetR6009_1: R6009.1 ; port MCU_RGMII_TXD2
NetR6009_2: R6009.2 U6000.67(RXD6_2)
NetR6010_1: R6010.1 ; port MCU_RGMII_TXD1
NetR6010_2: R6010.2 U6000.68(RXD6_1)
NetR6011_1: R6011.1 ; port MCU_RGMII_TXD0
NetR6011_2: R6011.2 U6000.69(RXD6_0)
NetR6017_1: R6017.1 R6020.1 ; port MCU_PTD16_MDIO
NetR6018_2: R6018.2 U6000.82(S_REXT)
NetR6019_1: R6019.1 U6000.99(INTRP_N) ; port ETH_INT
NetR6020_2: R6020.2 U6000.103(SDI/SDA/MDIO)
NetR6021_1: R6021.1 ; port MCU_PTD17_MDC
NetR6021_2: R6021.2 U6000.106(SCL/MDC)
NetR6025_1: R6025.1 U6000.130(ISET)
NetTP6000_1: TP6000.1 U6000.100(SYNCLKO)

Not connected (* = marked no-connect by the designer): U6000 33(NC_33) 34(NC_34) 38(NC_38) 39(NC_39) 54(TX_ER6) 55(COL6) 63(RX_ER6) 64(CRS6) 80(NC_80) 81(NC_81) 83(S_IN7M) 84(S_IN7P) 85(S_OUT7P) 86(S_OUT7M) 94(GPIO_1) 98(PME_N) 102(SDO) 105(SCS_N) 107(NC_107) 113(NC_113) 117(NC_117) 119(NC_119) 122(NC_122) 124(NC_124) 131(NC_131)

### Layout directives
differential pair; net class 100ohm Differential: TRXA1_N, TRXA1_P, TRXA2_N, TRXA2_P, TRXA3_N, TRXA3_P, TRXA4_N, TRXA4_P, TRXB1_N, TRXB1_P, TRXB2_N, TRXB2_P, TRXB3_N, TRXB3_P, TRXB4_N, TRXB4_P, TRXC1_N, TRXC1_P, TRXC2_N, TRXC2_P, TRXC3_N, TRXC3_P, TRXC4_N, TRXC4_P, TRXD1_N, TRXD1_P, TRXD2_N, TRXD2_P, TRXD3_N, TRXD3_P, TRXD4_N, TRXD4_P

### Notes on the sheet
- LED4_1, LED3_1   Management I/F
  0             0               MIIM
  0             1               I2C
  1             X              SPI *
- TITLE:
- PROJECT:
- Design by:
- Check by:
- Approve by:
- DRAWING NUMBER:
- REVISION:
- SIZE: A3
- SHEET NUMBER
- OFF
- DATE:
- (in symbol CMP-01174-1, part A) GIGABIT EHT PORT 1; MII/RMII/RGMII; GIGABIT EHT PORT 2; SGMII; GIGABIT EHT PORT 3; CONTROL; SPI; GIGABIT EHT PORT 4; CLK
- (in symbol CMP-01174-1, part B) 1.2V ANALOG; 2.5V ANALOG; 1.2V DIGITAL; 1.2V SGMII CORE; 2.5V SGMII IO
- (in symbol CMP-01175-1, part A) YLW; ORG; GRN
- (in symbol CMP-01175-1, part B) YLW; ORG; GRN
- (in symbol CMP-01175-1, part C) YLW; ORG; GRN
- (in symbol CMP-01175-1, part D) YLW; ORG; GRN

### Library data of the parts
C6000-C6007 C6012-C6015 C6051-C6054 = CMP-00063-4: CAP CER 100nF 50V X7R 0402; Manufacturer 1: Samsung; Crossable(YES/NO): YES; Mount Type(SMD/TH): SMD; Manufacturer Part Number 1: CL05B104KB54PNC; Max Operating Temperature: 125°C; Min Operating Temperature: -55°C; Height: 0.5mm; Lead Free: Lead Free; Mount: Surface Mount; Voltage Rating (DC): 50V
C6008 = CMP-00118-3: CAP CER 1000PF 2KV X7R 1206; Manufacturer 1: KEMET; Dielectric Material: Ceramic; Mount Type(SMD/TH): SMD; Tolerance: 10%; Crossable(YES/NO): YES; REACH SVHC: No SVHC; Case Code (Imperial): 1206; Dielectric: X7R; Packaging: Tape and Reel; Length: 0.126inch; Max Operating Temperature: 125°C; Thickness: 0.069inch; Min Operating Temperature: -55°C; Voltage Rating (DC): 2kV; Mount: Surface Mount; Width: 0.063inch; Manufacturer Part Number 1: C1206C102KGRACAUTO; Termination: SMD/SMT; Ratings: AEC-Q200; Case Code (Metric): 3216; Contact Plating: Tin,Matte; Height: 1.6mm; Lead Free: Lead Free
C6009 C6061-C6065 = CMP-00351-2: CAP CER 4.7uF 16V 10% X6S 0603 SMD; Manufacturer 1: Murata Electronics; Crossable(YES/NO): YES; Case Code (Imperial): 0603; Tolerance: 10%; Packaging: Tape and Reel; Width: 0.031inch; Case Code (Metric): 1608; Mount Type(SMD/TH): SMD; Min Operating Temperature: -55°C; Max Operating Temperature: 105°C; Mount: Surface Mount; Thickness: 0.035inch; Manufacturer Part Number 1: GRT188C81C475KE13D; Ratings: AEC-Q200; Length: 0.063inch; Height: 0.8mm; Lead Free: Lead Free; Voltage Rating (DC): 16V
C6010 C6011 = CMP-00205-2: CAP CER 15pF 50V 5% C0G 0402 SMD; Manufacturer 1: Murata Electronics; Crossable(YES/NO): YES; Manufacturer Part Number 1: GCM1555C1H150JA16D; Thickness: 0.022inch; Ratings: AEC-Q200; Case Code (Metric): 1005; Termination: SMD/SMT; Width: 0.5mm; Case Code (Imperial): 0402; Min Operating Temperature: -55°C; Dielectric: C0G; Tolerance: 5%; Packaging: Tape and Reel; Mount Type(SMD/TH): SMD; Height: 0.5mm; Max Operating Temperature: 125°C; Weight: 0.000212oz; Package Quantity: 10000; Mount: Surface Mount; Length: 0.039inch; Voltage Rating (DC): 50V; Lead Free: Lead Free
C6016-C6024 C6026-C6028 C6030-C6036 C6038-C6049 C6055 C6056 C6058 C6059 = CMP-00988-1: as C5001 on sheet 10- RS485; Case Code (Imperial): 0402; Case Code (Metric): 1005; Dielectric: X7R; Manufacturer Part Number 1: 0402YC104KAT2A; Max Operating Temperature: 125°C; Min Operating Temperature: -55°C; Mount: Surface Mount; Voltage Rating: 16V
C6025 C6029 C6037 C6050 C6057 C6060 = CMP-ROOT-0068-6: CAP CER 22uF 25V 20% X5R 0805 SMD; Manufacturer 1: Murata Electronics; Crossable(YES/NO): YES; Height: 1.25mm; Length: 0.079inch; Max Operating Temperature: 85°C; Tolerance: 20%; Mount Type(SMD/TH): SMD; Manufacturer Part Number 1: GRM21BR61E226ME44K; Weight: 0.000335oz; Dielectric: X5R; Packaging: Tape and Reel; Package Quantity: 10000; Mount: Surface Mount; Termination: SMD/SMT; Composition: Ceramic; Case Code (Imperial): 0805; Thickness: 0.057inch; Voltage Rating (DC): 25V; Case Code (Metric): 2012; Width: 1.25mm; Min Operating Temperature: -55°C; Lead Free: Lead Free
FB6000-FB6005 = CMP-ROOT-0013-6: FERRITE BEAD 120 OHM 0603 1LN; Manufacturer 1: Murata Electronics; Mount Type(SMD/TH): SMD; Max Current Rating: 3A; Number of Circuits: 1; Crossable(YES/NO): YES; DC Resistance (DCR): 30mR; Manufacturer Part Number 1: BLM18KG121TH1D; Height: 0.03inch; Package Quantity: 1; Max Operating Temperature: 125°C; Mount: Surface Mount; Ratings: AEC-Q200; Min Operating Temperature: -55°C; Number of Lines: 1; Length: 0.063inch; Packaging: Tape and Reel; Case Code (Metric): 1608; Width: 0.032inch; Case Code (Imperial): 0603
J6000 = CMP-01175-1: CONN JACK 4PORT PCB; Manufacturer: Bel Fuse; Gender: Female; Connector Type: RJ45; Direction: Up; Number of Contacts: 32; Number of Cores per Jack: 8; Number of Ports: 4; Plating Thickness: 1.27µm; Row Spacing: 2.54mm; Shielding: Shielded; Category: Modular / Ethernet Connectors; Color: Green, Orange, Yellow; Contact Gender: Female; Contact Plating: Gold; Housing Material: PBT; Lead Free: Lead Free; Lifecycle Status: Production; Manufacturer Part Number: 0826-1X4T-43-F; Max Operating Temperature: 70°C; Min Operating Temperature: 0°C; Mounting Technology: Through Hole; Pins: 32; Number of Rows: 2; Orientation: Right Angle; REACH SVHC: Yes; RoHS: Compliant; Shell Finish: Nickel; Terminal Pitch: 2.54mm; Termination: Solder
R6000 R6002-R6006 R6008-R6011 = CMP-00237-1: RES SMD 22 OHM 5% 1/16W 0402; Manufacturer 1: Vishay Dale; Power Rating: 63mW; Voltage Rating: 50V; Temperature Coefficient: 200ppm/°C; Crossable(YES/NO): NO; Contact Plating: Tin; Max Power Dissipation: 63mW; Height: 0.016inch; Width: 0.5mm; Packaging: Tape and Reel; Package Quantity: 1; Weight: 2.3E-05oz; Depth: 0.5mm; Tolerance: 5%; Case Code (Imperial): 0402; Features: Automotive AEC-Q200; Max Operating Temperature: 155°C; Min Operating Temperature: -55°C; Military Standard: Not; Termination: SMD/SMT; Manufacturer Part Number 1: CRCW040222R0JNED; Case Code (Metric): 1005; Length: 1mm; Composition: Thick Film; REACH SVHC: Unknown; Number of Pins: 2; Mount Type(SMD/TH): SMD; Number of Terminations: 2; Case/Package: 0402
R6001 R6007 R6020 R6021 = CMP-ROOT-0037-10: RES 0R 1/16W 1% 0402 SMD; Manufacturer 1: Stackpole Electronics Inc; Max Power Dissipation: 63mW; Crossable(YES/NO): YES; Current Rating: 1A; Working Voltage: 50V; Height: 0.016inch; Radiation Hardening: No; Max Operating Temperature: 155°C; Min Operating Temperature: -55°C; Lead Free: Lead Free; Contact Plating: Tin,Matte; Number of Terminations: 2; Features: Automotive AEC-Q200; Case Code (Metric): 1005; Mount: Surface Mount; Packaging: Tape and Reel; Width: 0.02inch; Mount Type(SMD/TH): SMD; Length: 0.039inch; Depth: 0.5mm; Composition: Thick Film; Power Rating: 63mW; Military Standard: Not; Case Code (Imperial): 0402; Manufacturer Part Number 1: RMCF0402ZT0R00; Case/Package: 0402
R6012-R6015 R6024 R6026 R6027 R6030 = CMP-01126-1: RES SMD 220 OHM 1% 1/10W 0402; Manufacturer: Vishay; Package Height: 0.35mm; Package Length: 1mm; Package Width: 0.5mm; Power: 63mW; Rated Temperature: 70°C; Reference Standard: AEC-Q200; Temperature Coefficient (ppm/Cel): 100; Working Voltage: 50V; Category: Chip SMD Resistors; Construction: Chip; JESD-609 Code: e3; Manufacturer Part Number: CRCW0402220RFKED; Max Operating Temperature: 155°C; Min Operating Temperature: -55°C; Mounting Technology: Surface Mount; Pins: 2; Package Shape: Rectangular; Packaging: Tape and Reel; Reach SVHC Compliant: Yes; Resistor Type: FIXED RESISTOR; RoHS Compliant: Yes; Case/Package: 0402; Technology: METAL GLAZE/THICK FILM; Terminal Finish: Nickel; Termination: Wraparound; Tolerance: 1%
R6016 = CMP-01176-1: RES 330 OHM 5% 1/10W 0603; Manufacturer: Yageo Group; Power Dissipation: 100mW; Temperature Coefficient: 100ppm/°C; Voltage Rating: 50V; Working Voltage: 75V; Height: 450µm; Case Code (Imperial): 0603; Case/Package: 0603; Category: Chip SMD Resistors; China RoHS: Non-Compliant; Composition: Thick Film; Depth: 800µm; Lead Free: Lead Free; Length: 1.6mm; Lifecycle Status: Production; Manufacturer Part Number: RC0603JR-07330RL; Max Operating Temperature: 155°C; Military Standard: Not; Min Operating Temperature: -55°C; Mounting Technology: Surface Mount; Pins: 2; Number of Terminals: 2; Packaging: Cut Tape; Power Rating: 100mW; REACH SVHC: Yes; RoHS: Compliant; Schedule B: 8533210045, 8533210045|8533210045, 8533210045|8533210045|8533210045, 8533210045|8533210045|8533210045|8533210045; Termination: SMD/SMT; Tolerance: 5%; Voltage Rating (AC): 50V; Voltage Rating (DC): 50V; Width: 800µm
R6017 R6019 R6022 R6023 R6028 R6029 R6031 R6032 = CMP-01105-1: RES 10K OHM 1% 1/16W 0402; Manufacturer: Stackpole Electronics; Package Length: 1mm; Package Height: 0.3mm; Package Width: 0.5mm; Power: 63mW; Rated Temperature: 70°C; Reference Standard: AEC-Q200; Temperature Coefficient (ppm/Cel): 100; Working Voltage: 50V; Category: Chip SMD Resistors; Construction: Rectangular; JESD-609 Code: e3; Manufacturer Part Number: RMCF0402FT10K0; Max Operating Temperature: 155°C; Min Operating Temperature: -55°C; Mounting Technology: Surface Mount; Pins: 2; Package Shape: Rectangular; Packaging: Tape and Reel; Reach SVHC Compliant: Yes; Resistor Type: FIXED RESISTOR; RoHS Compliant: Yes; Technology: METAL GLAZE/THICK FILM; Terminal Finish: Nickel; Termination: Wraparound
R6018 = CMP-00798-1: RES SMD 200 OHM 1% 1/16W 0402; Manufacturer 1: Yageo; Power Rating: 63mW; Crossable(YES/NO): YES; Temperature Coefficient: 100ppm/°C; Mount Type(SMD/TH): SMD; Max Operating Temperature: 155°C; Case Code (Imperial): 0402; Number of Terminations: 2; Composition: Thick Film; Max Power Dissipation: 63mW; Lead Free: Lead Free; Tolerance: 1%; Width: 0.02inch; Features: Moisture Resistant,Automotive AEC-Q200; Height: 0.015inch; Case Code (Metric): 1005; Min Operating Temperature: -55°C; Packaging: Tape and Reel; Length: 0.039inch; Manufacturer Part Number 1: AC0402FR-07200RL
R6025 = CMP-01177-1: RES 6.04K OHM 1% 1/16W 0402; Manufacturer: Vishay; Power Dissipation: 63mW; Temperature Coefficient: 100ppm/°C; Working Voltage: 50V; Lifecycle Status: Production; Case/Package: 0402; Category: Chip SMD Resistors; China RoHS: Non-Compliant; Height: 300µm; Lead Free: Lead Free; Manufacturer Part Number: CRCW04026K04FKEDC; Max Operating Temperature: 155°C; Min Operating Temperature: -55°C; Mounting Technology: Surface Mount; Number of Terminals: 2; REACH SVHC: Yes; RoHS: Compliant; Schedule B: 8533210045, 8533210045|8533210045|8533210045|8533210045|8533210045; Width: 500µm
TP6000 = CMP-ROOT-0080-12: Test Point 1x1mm; Manufacturer Part Number 1: NA; Mount Type(SMD/TH): TH; Crossable(YES/NO): YES; Manufacturer 1: N/A
U6000 = CMP-01174-1: 6-PORT GIGE MANAGED SWITCH WITH; Manufacturer: Microchip; Country of Fabrication: Taiwan; Case/Package: VQFN; Category: Integrated Circuits (ICs); Country of Assembly: Taiwan; Country of Origin: Taiwan; Export Control Classification Number (ECCN) Code: EAR99; Harmonized Tariff Schedule (HTS) Code: 8542.39.0060; Introduction Date: 2024-08-02; Lifecycle Status: Production; Manufacturer Part Number: LAN9646-I/MXX; Pins: 132; Projected EOL Date: 2049-07-17
Y6000 = CMP-00003-5: CRYSTAL 25.0000MHZ 8PF SMD; Manufacturer 1: NDK America, Inc.; ESR (Equivalent Series Resistance): 100R; Crossable(YES/NO): NO; Frequency: 25MHz; Frequency Stability: 50ppm; Frequency Tolerance: 15ppm; Height: 0.024inch; Width: 0.098inch; Length: 0.126inch; Packaging: Tape and Reel; Mount: Surface Mount; Max Operating Temperature: 125°C; Min Operating Temperature: -40°C; Manufacturer Part Number 1: NX3225SA-25.000M-STD-CRS-2; Mount Type(SMD/TH): SMD; Case/Package: SMD/SMT; Load Capacitance: 8pF; Ratings: AEC-Q200